# EAGLE schematic Sensor_RPM (EAGLE 9.6.2)
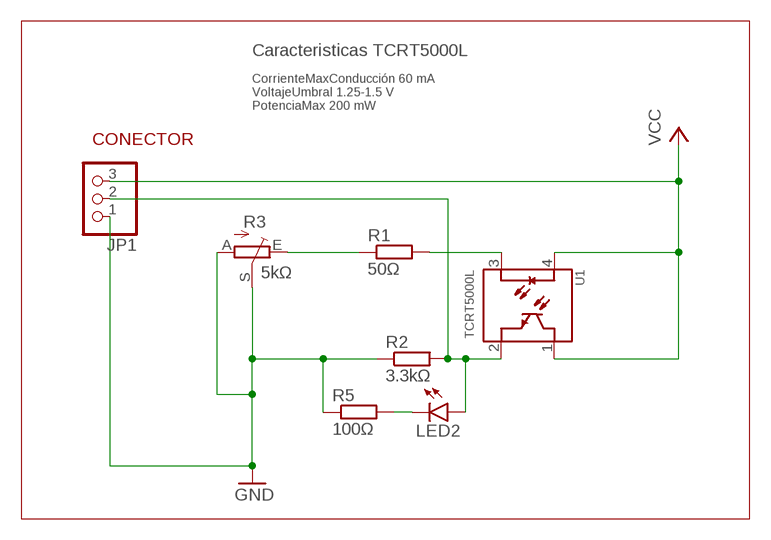
[diagram p0: schematic, sheet 1]

## Parts
JP1  PINHD-1X3  [1X03]
LED2  LEDCHIP-LED0805  [CHIP-LED0805]
R1  50Ω  R-EU_R0805  [R0805]
R2  3.3kΩ  R-EU_R0805  [R0805]
R3  5kΩ  TRIM_EU-CT6  [CT6]
R5  100Ω  R-EU_R0805  [R0805]
U1  TCRT5000L  [PCBMOUNT]

## Nets
GND: JP1.1 R2.1 R3.A R3.S R5.1
N$1: R1.2 U1.3(C)
N$2: JP1.2 LED2.A R2.2 U1.2(E)
N$3: LED2.C R5.2
N$4: R1.1 R3.E
VCC: JP1.3 U1.1(CO) U1.4(A)

## Notes on the sheet
- Caracteristicas TCRT5000L
- CorrienteMaxConducción 60 mA
  VoltajeUmbral 1.25-1.5 V
  PotenciaMax 200 mW
- CONECTOR

## Library data of the parts
JP1 = pinhead:PINHD-1X3: PIN HEADER; PARTNO: PPPC031LFBN-RC
LED2 = led:LED: LED OSRAM: - CHIPLED LG R971, LG N971, LY N971, LG Q971, LY Q971, LO R971, LY R971 LH N974, LH R974 LS Q976, LO Q976, LY Q976 LO Q996 - Hyper CHIPLED LW Q18S LB Q993, LB Q99A, LB R99A - SideLED LS A670, LO A670, LY A670, LG A670, LP A670 LB A673, LV A673, LT A673, LW A673 LH A674 LY A675 LS A676, LA A676, LO A676, LY A676, LW A676 LS A679, LY A679, LG A679 - Hyper Micro SIDELED® LS Y876, LA Y876, LO Y876, LY Y876 LT Y87S - SmartLED LW L88C, LW L88S LB L89C, LB L89S, LG L890 LS L89K, LO L89K, LY L89K LS L896, LA L896, LO L896, LY L896 - TOPLED LS T670, LO T670, LY T670, LG T670, LP T670 LSG T670, LSP T670, LSY T670, LOP T670, LYG T670 LG T671, LOG T671, LSG T671 LB T673, LV T673, LT T673, LW T673 LH T674 LS T676, LA T676, LO T676, LY T676, LB T676, LH T676, LSB T676, LW T676 LB T67C, LV T67C, LT T67C, LS T67K, LO T67K, LY T67K, LW E67C LS E67B, LA E67B, LO E67B, LY E67B, LB E67C, LV E67C, LT E67C LW T67C LS T679, LY T679, LG T679 LS T770, LO T770, LY T770, LG T770, LP T770 LB T773, LV T773, LT T773, LW T773 LH T774 LS E675, LA E675, LY E675, LS T675 LS T776, LA T776, LO T776, LY T776, LB T776 LHGB T686 LT T68C, LB T68C - Hyper Mini TOPLED® LB M676 - Mini TOPLED Santana® LG M470 LS M47K, LO M47K, LY M47K Source: http://www.osram.convergy.de LUXEON: - LUMILED® LXK2-PW12-R00, LXK2-PW12-S00, LXK2-PW14-U00, LXK2-PW14-V00 LXK2-PM12-R00, LXK2-PM12-S00, LXK2-PM14-U00 LXK2-PE12-Q00, LXK2-PE12-R00, LXK2-PE12-S00, LXK2-PE14-T00, LXK2-PE14-U00 LXK2-PB12-K00, LXK2-PB12-L00, LXK2-PB12-M00, LXK2-PB14-N00, LXK2-PB14-P00, LXK2-PB14-Q00 LXK2-PR12-L00, LXK2-PR12-M00, LXK2-PR14-Q00, LXK2-PR14-R00 LXK2-PD12-Q00, LXK2-PD12-R00, LXK2-PD12-S00 LXK2-PH12-R00, LXK2-PH12-S00 LXK2-PL12-P00, LXK2-PL12-Q00, LXK2-PL12-R00 Source: www.luxeon.com KINGBRIGHT: KA-3528ASYC Source: www.kingbright.com; PARTNO: EAST2012GA0
R1 = rcl:R-EU_: RESISTOR, European symbol; PARTNO: RT0805FRE0751RL; SPICEPREFIX: R
R2 = rcl:R-EU_: RESISTOR, European symbol; PARTNO: RC0402FR-073K3L; SPICEPREFIX: R
R3 = pot:TRIM_EU-: POTENTIOMETER; PARTNO: CT-6EP502
R5 = rcl:R-EU_: RESISTOR, European symbol; PARTNO: RC0805FR-07100RL; SPICEPREFIX: R
U1 = TCRT5000L-Vishay:TCRT5000L: TCRT5000 Series 940 nm 100 mA 60 mA Transistor Output Reflective Optical Sensor; CHECK_PRICES: https://www.snapeda.com/parts/TCRT5000L/Vishay+Semiconductor+Opto+Division/view-part/?ref=eda; DESCRIPTION: Reflective Optical Sensor 0.591 (15mm) PCB Mount; MF: Vishay; MP: TCRT5000L; PACKAGE: PCB Mount Vishay Semiconductor; PURCHASE-URL: https://www.snapeda.com/api/url_track_click_mouser/?unipart_id=229608&manufacturer=Vishay&part_name=TCRT5000L&search_term=None; SNAPEDA_LINK: https://www.snapeda.com/parts/TCRT5000L/Vishay+Semiconductor+Opto+Division/view-part/?ref=snap